# Altium schematic sheet Interface_Board_Top.SchDoc
size A4; CompanyName: Technische Hochschule Nürnberg Georg Simon Ohm; Organization: UltraZohm; Address1: Kesslerplatz 12; Address2: 90489 Nürnberg; Address3: GERMANY; DocumentNumber: 1; SheetNumber: 1; SheetTotal: 6; Website: www.ultrazohm.com
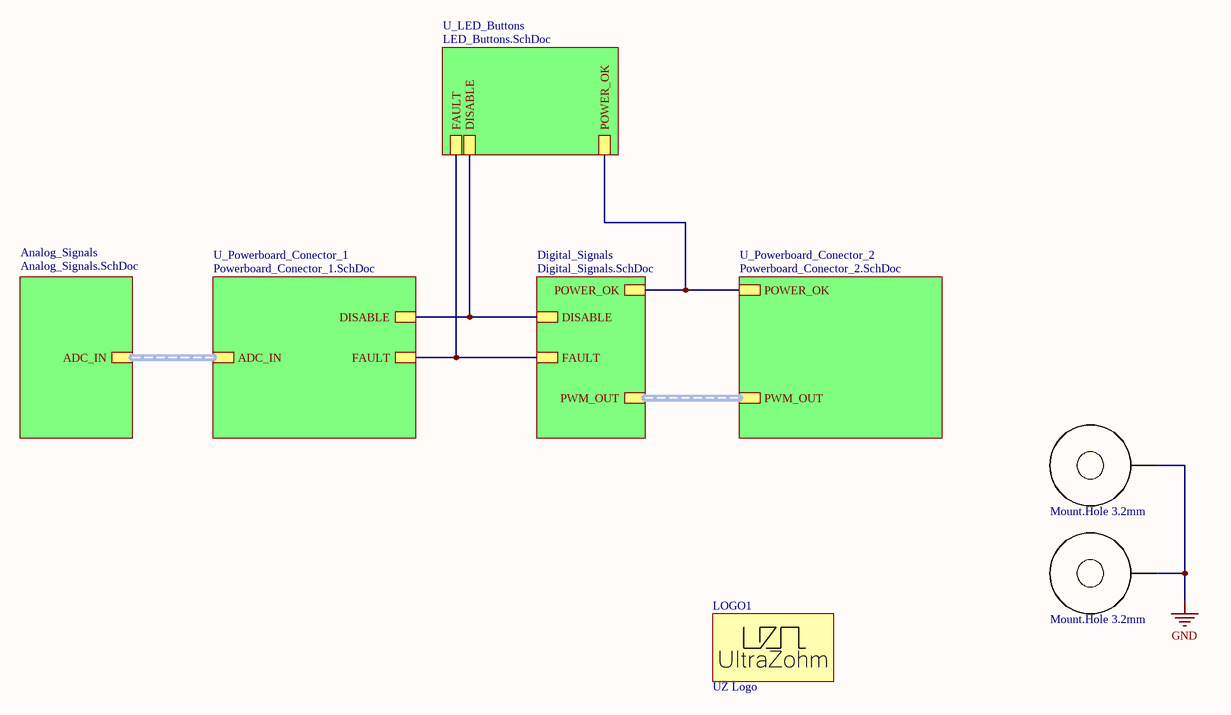
[diagram p0: Interface_Board_Top.SchDoc]

## Parts
H1  Mount.Hole 3.2mm  [MHole3_2mm_No_Screw]  (no BOM)
H2  Mount.Hole 3.2mm  [MHole3_2mm_No_Screw]  (no BOM)
LOGO1  UZ Logo  [UZ_Logo_tiny]  (no BOM)

## Sub-sheets
Analog_Signals = Analog_Signals.SchDoc: ADC_IN (harness ADC_IN)
Digital_Signals = Digital_Signals.SchDoc: POWER_OK, FAULT, DISABLE, PWM_OUT (harness PWM_OUT)
U_LED_Buttons = LED_Buttons.SchDoc: POWER_OK, DISABLE, FAULT
U_Powerboard_Conector_1 = Powerboard_Conector_1.SchDoc: FAULT, DISABLE, ADC_IN (harness ADC_IN)
U_Powerboard_Conector_2 = Powerboard_Conector_2.SchDoc: PWM_OUT (harness PWM_OUT), POWER_OK

## Nets
GND: H1.1 H2.1
(unnamed): sheet Digital_Signals/POWER_OK, sheet U_LED_Buttons/POWER_OK, sheet U_Powerboard_Conector_2/POWER_OK
(unnamed): sheet Digital_Signals/FAULT, sheet U_LED_Buttons/FAULT, sheet U_Powerboard_Conector_1/FAULT
(unnamed): sheet Digital_Signals/DISABLE, sheet U_LED_Buttons/DISABLE, sheet U_Powerboard_Conector_1/DISABLE

## Buses and harness runs
harness sheet Analog_Signals/ADC_IN = sheet U_Powerboard_Conector_1/ADC_IN
harness sheet Digital_Signals/PWM_OUT = sheet U_Powerboard_Conector_2/PWM_OUT

## Notes on the sheet
- Title
- Revision:
- Design Engineer:
- Date:
- Project:
- Sheet
- of

## Library data of the parts
H1 H2 = MHole: AN: 22898; Mixed: THT
LOGO1 = UZ Logo: UltraZohm Logo on PCB; Created: Jan2021_Liegmann; Value: UZ Logo